# EAGLE design rbtnk_bsp (EAGLE 7.7.0)
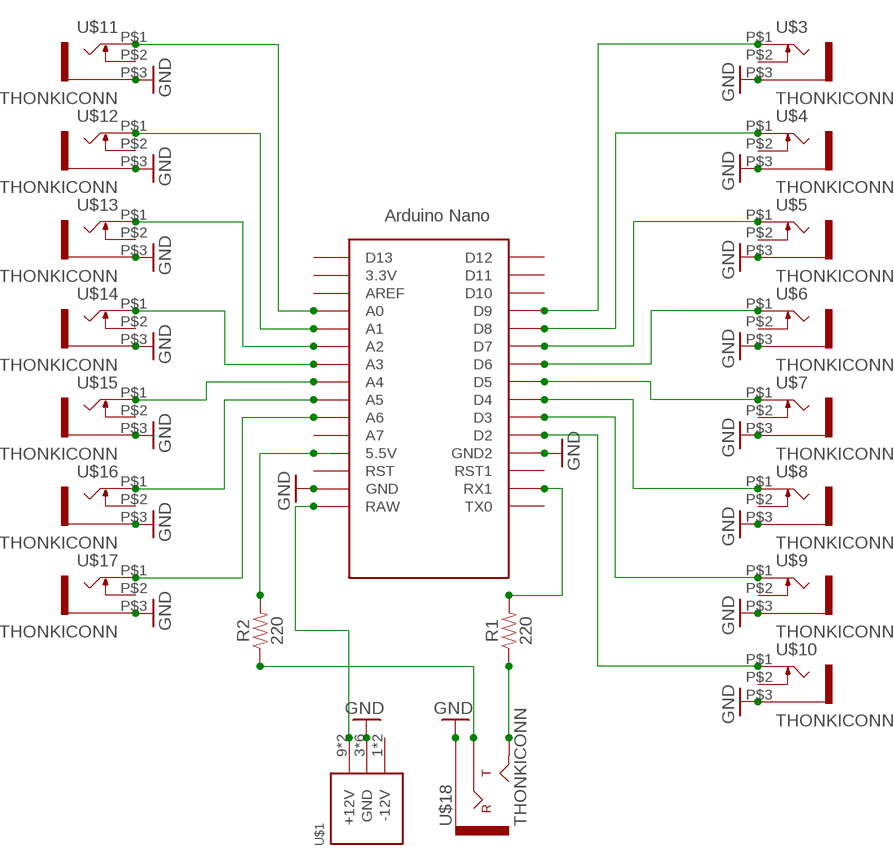
[diagram p0: schematic, sheet 1]

## Parts
R1  220  220OHM-0603-1/10W-1%  [0603]
R2  220  220OHM-0603-1/10W-1%  [0603]
U$1  POWER_SIMPLE10  [POWER_10]
U$2  NANO  [NANO]
U$3  THONKICONN  [THONKICONN]
U$4  THONKICONN  [THONKICONN]
U$5  THONKICONN  [THONKICONN]
U$6  THONKICONN  [THONKICONN]
U$7  THONKICONN  [THONKICONN]
U$8  THONKICONN  [THONKICONN]
U$9  THONKICONN  [THONKICONN]
U$10  THONKICONN  [THONKICONN]
U$11  THONKICONN  [THONKICONN]
U$12  THONKICONN  [THONKICONN]
U$13  THONKICONN  [THONKICONN]
U$14  THONKICONN  [THONKICONN]
U$15  THONKICONN  [THONKICONN]
U$16  THONKICONN  [THONKICONN]
U$17  THONKICONN  [THONKICONN]
U$18  THONKICONN  [THONKICONN]

## Nets
GND: U$1.3(GND) U$1.4(GND) U$1.5(GND) U$1.6(GND) U$1.7(GND) U$1.8(GND) U$2.GND U$2.GND1(GND2) U$3.P$3 U$4.P$3 U$5.P$3 U$6.P$3 U$7.P$3 U$8.P$3 U$9.P$3 U$10.P$3 U$11.P$3 U$12.P$3 U$13.P$3 U$14.P$3 U$15.P$3 U$16.P$3 U$17.P$3 U$18.P$1(EARTH)
N$1: U$2.A0 U$11.P$1
N$2: U$2.A1 U$12.P$1
N$3: U$2.A2 U$13.P$1
N$4: U$2.A3 U$14.P$1
N$5: U$2.A4 U$15.P$1
N$6: U$2.A5 U$16.P$1
N$7: U$2.A6 U$17.P$1
N$8: U$2.D2 U$10.P$1
N$9: U$2.D3 U$9.P$1
N$10: U$2.D4 U$8.P$1
N$11: U$2.D5 U$7.P$1
N$12: U$2.D6 U$6.P$1
N$13: U$2.D7 U$5.P$1
N$14: U$2.D8 U$4.P$1
N$15: U$2.D9 U$3.P$1
N$16: R2.2 U$2.5V(5.5V)
N$17: R2.1 U$18.P$2(RING)
N$18: R1.1 U$18.P$3(TIP)
N$19: R1.2 U$2.RX1
N$20: U$1.9(+12V) U$1.10(+12V) U$2.RAW
Unconnected: U$1.1(-12V) U$1.2(-12V) U$2.3.3V U$2.A7 U$2.AREF U$2.D10 U$2.D11 U$2.D12 U$2.D13 U$2.ICSP1 U$2.ICSP2 U$2.ICSP3 U$2.ICSP4 U$2.ICSP5 U$2.ICSP6 U$2.RST U$2.RST1 U$2.TX0 U$3.P$2 U$4.P$2 U$5.P$2 U$6.P$2 U$7.P$2 U$8.P$2 U$9.P$2 U$10.P$2 U$11.P$2 U$12.P$2 U$13.P$2 U$14.P$2 U$15.P$2 U$16.P$2 U$17.P$2

## Library data of the parts
R1 R2 = SparkFun-Resistors:220OHM: 220Ω resistor A resistor is a passive two-terminal electrical component that implements electrical resistance as a circuit element. Resistors act to reduce current flow, and, at the same time, act to lower voltage levels within circuits. - Wikipedia; PROD_ID: RES-07861
U$1 = eurorack_power:POWER_SIMPLE
U$2 = Arduino-clone:NANO: Arduino Nano
U$3-U$17 = thonkiconn:THONKICONN
U$18 = pj301cm:THONKICONN

## Board
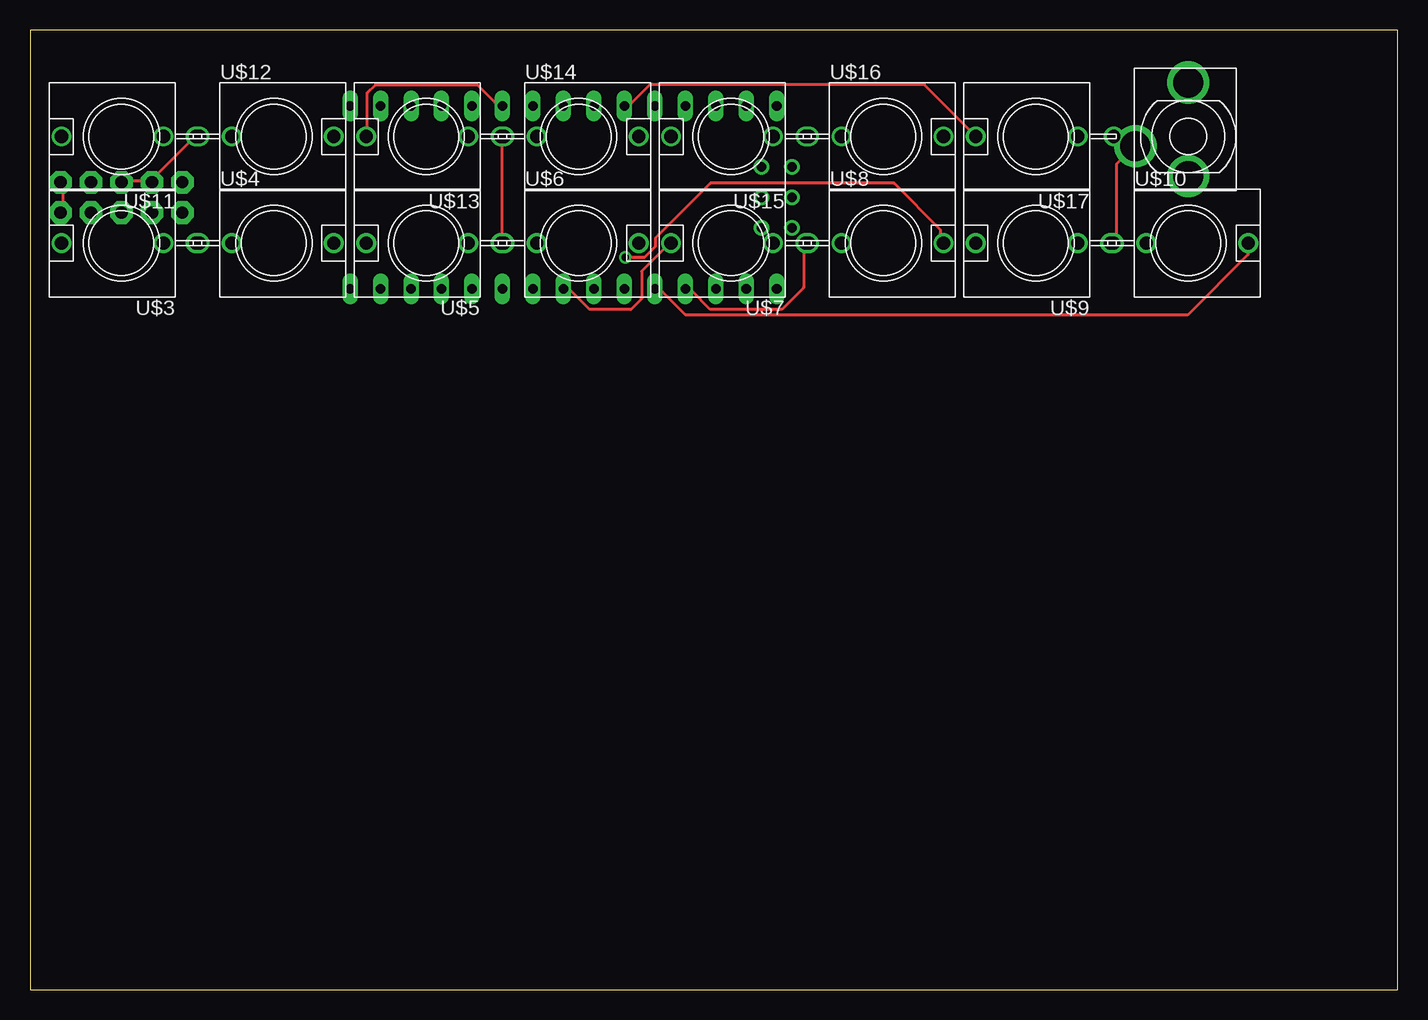
[diagram p1: board, top side]
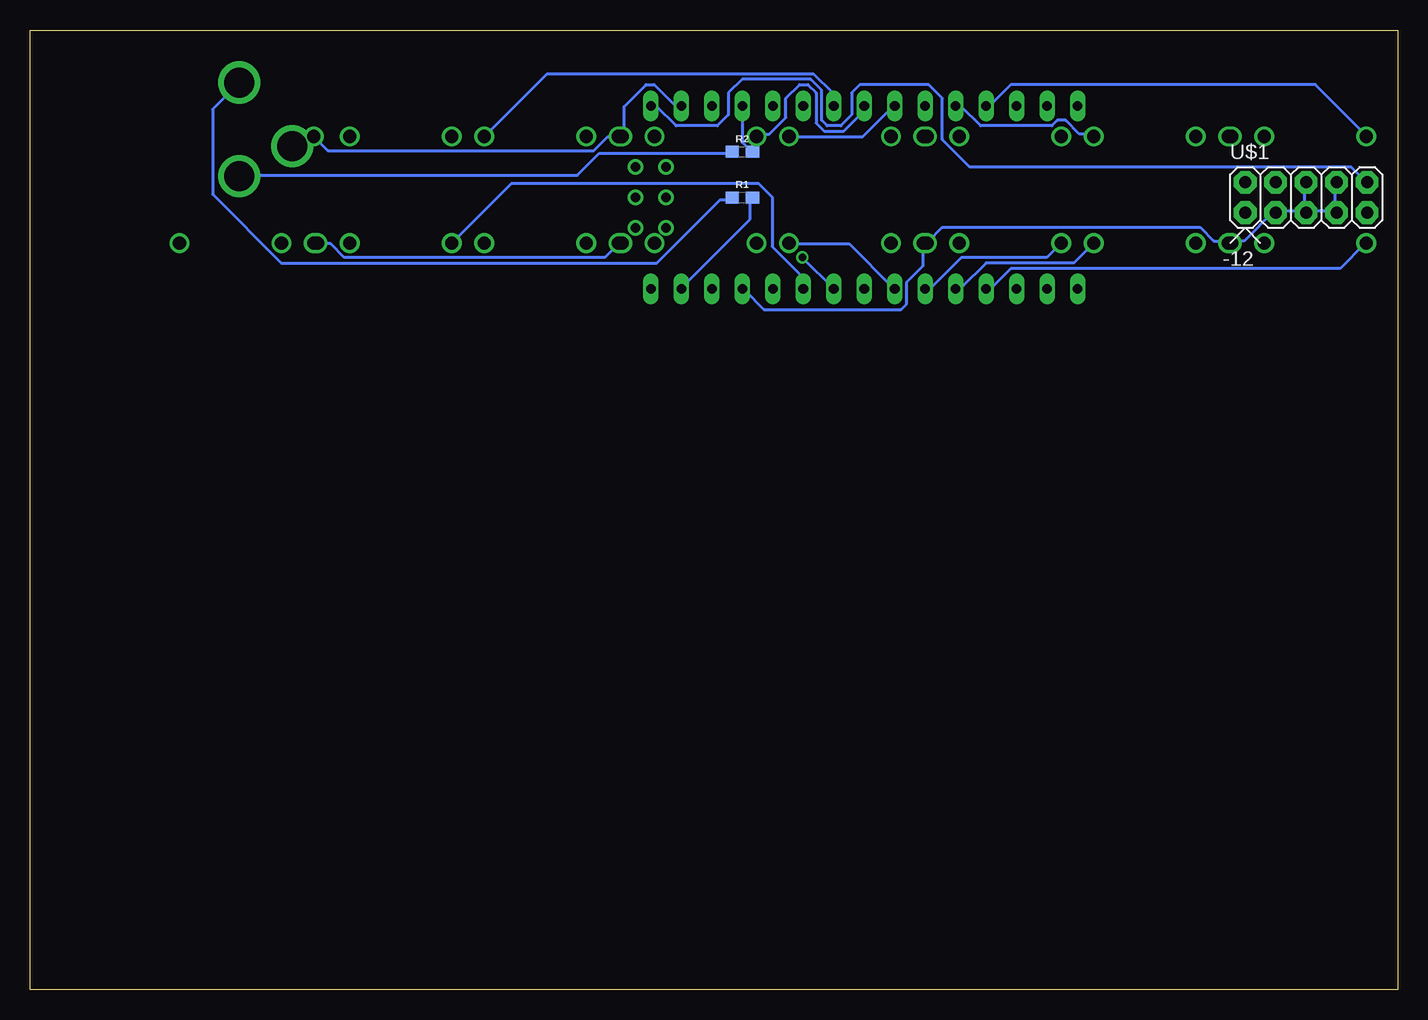
[diagram p2: board, bottom side, seen from below]

Size 113.97 x 80 mm. Coordinates in mm from the lower left corner, seen from the top.
Outline: 0,0 113.97,0 113.97,80 0,80 0,0
Copper layers (1*16): Top 0.035mm / dielectric 1.5mm / Bottom 0.035mm
Design rules "default": minimum track width 10mil, minimum drill 24mil, track to track 8mil, track to pad 8mil, pad to pad 8mil, via to via 8mil, smd to smd 8mil, copper to edge 40mil, drill to drill 8mil, minimum pad ring 10mil, minimum via ring 8mil, stop-mask expansion 4mil, vias tented up to drill 0mil, thermal gap 10mil

### Footprints (pad centres in the part's own frame; a part is rotated, then mirrored left to right if it is on the bottom)
0603 = smd 1.1 x 1: 1 -0.85,0; 2 0.85,0
POWER_10 = drill 1.016 pad 1.88 octagon: 1 -5.08,-1.27; 2 -5.08,1.27; 3 -2.54,-1.27; 4 -2.54,1.27; 5 0,-1.27; 6 0,1.27; 7 2.54,-1.27; 8 2.54,1.27; 9 5.08,-1.27; 10 5.08,1.27
NANO = drill 0.8 long: 3.3V -10.16,24.13; 5V -10.16,-1.27; A0 -10.16,19.05; A1 -10.16,16.51; A2 -10.16,13.97; A3 -10.16,11.43; A4 -10.16,8.89; A5 -10.16,6.35; A6 -10.16,3.81; A7 -10.16,1.27; AREF -10.16,21.59; D2 5.08,1.27; D3 5.08,3.81; D4 5.08,6.35; D5 5.08,8.89; D6 5.08,11.43; D7 5.08,13.97; D8 5.08,16.51; D9 5.08,19.05; D10 5.08,21.59; D11 5.08,24.13; D12 5.08,26.67; D13 -10.16,26.67; GND -10.16,-6.35; GND1 5.08,-1.27; RAW -10.16,-8.89; RST -10.16,-3.81; RST1 5.08,-3.81; RX1 5.08,-6.35; TX0 5.08,-8.89 | drill 0.8: ICSP1 -5.08,-10.16; ICSP2 -5.08,-7.62; ICSP3 -2.54,-10.16; ICSP4 -2.54,-7.62; ICSP5 0,-10.16; ICSP6 0,-7.62
THONKICONN = drill 1.1: P$1 0,5; P$2 0,-3.5; P$3 0,-6.5
THONKICONN' = drill 2.5: P$1 4.4,0.8; P$2 0,3.3; P$3 0,-4.5

### Placement (x,y rotation side)
R1  54.61,66.04 0 bottom
R2  54.61,69.85 0 bottom
U$1  7.62,66.04 0 bottom
U$2  53.34,63.5 270 bottom
U$3  7.62,62.23 90 top
U$4  20.32,62.23 270 top
U$5  33.02,62.23 90 top
U$6  45.72,62.23 270 top
U$7  58.42,62.23 90 top
U$8  71.12,62.23 270 top
U$9  83.82,62.23 90 top
U$10  96.52,62.23 270 top
U$11  7.62,71.12 90 top
U$12  20.32,71.12 270 top
U$13  33.02,71.12 90 top
U$14  45.72,71.12 270 top
U$15  58.42,71.12 90 top
U$16  71.12,71.12 270 top
U$17  83.82,71.12 90 top
U$18  THONKICONN  [THONKICONN']  96.52,71.12 180 top

### Tracks (layer width: path | path; a pad name or v marks a point on that pad's centre or on a via)
GND
  Top 0.254: U$15.P$3 64.69,71.09 U$16.P$3 | U$9.P$3 90.3,62.18 90.07,62.18 U$10.P$3 90.53,62.41 90.53,68.81 91.9,70.18 U$18.P$1 91.9,70.41 91.21,71.09 90.53,71.09 U$17.P$3 | U$11.P$3 13.95,71.09 U$12.P$3 13.72,71.09 10.06,67.44 | U$4.P$3 13.95,62.18 U$3.P$3 | 10.06,67.44 7.77,67.44 U$1.6 | 10.06,67.44 U$1.4 | U$5.P$3 39.32,62.18 U$6.P$3 39.32,62.41 39.32,71.09 | 39.32,71.09 U$13.P$3 | 39.32,71.09 U$14.P$3 | U$2.GND1 54.63,58.29 55.09,58.29 56.69,56.69 62.64,56.69 64.47,58.52 64.47,62.18 U$8.P$3 64.69,62.18 U$7.P$3
  Bottom 0.254: U$2.GND 59.89,73.84 60.35,73.84 61.95,75.44 62.64,75.44 64.47,73.61 64.47,71.32 U$16.P$3 | U$15.P$3 64.92,71.09 65.84,71.09 66.98,69.95 89.15,69.95 90.3,71.09 U$17.P$3 | 5.26,64.92 5.26,67.21 U$1.8 | 7.77,64.92 7.77,67.21 U$1.6 | 5.26,64.92 7.54,64.92 U$1.5 7.77,64.92 | 5.26,64.92 U$1.7 | 7.77,64.92 10.06,64.92 U$1.3 10.29,64.92 12.8,62.41 13.72,62.41 U$4.P$3 14.17,62.41 15.32,62.41 16.46,63.55 37.95,63.55 39.09,62.41 U$6.P$3 39.55,62.18 39.55,60.35 40.92,58.98 40.92,57.15 41.38,56.69 52.81,56.69 54.41,58.29 U$2.GND1 | U$10.P$3 89.84,62.18 88.92,62.18 87.78,61.04 66.06,61.04 64.92,62.18 U$7.P$3
N$1
  Bottom 0.254: U$2.A0 34.29,73.84 33.83,73.84 32.23,75.44 6.86,75.44 2.74,71.32 U$11.P$1
N$2
  Bottom 0.254: U$2.A1 36.8,73.61 36.35,73.61 34.75,72.01 28.8,72.01 28.35,72.47 27.66,72.47 26.52,71.32 25.38,71.32 U$12.P$1
N$3
  Top 0.254: U$2.A2 39.32,73.84 38.86,73.84 37.26,75.44 28.8,75.44 28.12,74.75 28.12,71.32 U$13.P$1
N$4
  Bottom 0.254: U$2.A3 42.06,73.61 44.58,71.09 50.52,71.09 U$14.P$1
N$5
  Bottom 0.254: U$2.A4 44.58,73.61 44.58,73.15 46.18,71.55 47.78,71.55 48.46,72.24 48.46,74.75 49.15,75.44 49.84,75.44 50.98,74.3 50.98,72.69 52.35,71.32 53.26,71.32 U$15.P$1
N$6
  Bottom 0.254: U$2.A5 47.09,73.84 47.09,74.75 48.69,76.35 70.87,76.35 75.89,71.32 U$16.P$1
N$7
  Top 0.254: U$2.A6 49.61,73.84 50.06,73.84 51.66,75.44 74.52,75.44 78.64,71.32 U$17.P$1
N$8
  Top 0.254: U$2.D2 52.12,58.29 52.58,58.29 54.63,56.24 96.47,56.24 101.5,61.27 101.5,62.18 U$10.P$1
N$9
  Bottom 0.254: U$2.D3 49.61,58.52 49.61,59.44 52.12,61.95 52.12,66.06 53.26,67.21 73.84,67.21 78.64,62.41 U$9.P$1
N$10  (via drill 0.61)
  Top 0.254: v49.61,61.04 51.21,61.04 52.12,61.95 52.12,62.64 56.69,67.21 72.01,67.21 75.89,63.32 75.89,62.41 U$8.P$1
  Bottom 0.254: v49.61,61.04 U$2.D4
N$11
  Top 0.254: U$2.D5 44.58,58.29 45.03,58.29 46.63,56.69 50.06,56.69 50.98,57.61 50.98,59.89 53.26,62.18 U$7.P$1
N$12
  Bottom 0.254: U$2.D6 42.06,58.52 45.72,62.18 50.52,62.18 U$6.P$1
N$13
  Bottom 0.254: U$2.D7 39.32,58.52 38.86,58.52 36.35,61.04 29.26,61.04 28.12,62.18 U$5.P$1
N$14
  Bottom 0.254: U$2.D8 36.8,58.52 36.35,58.52 34.29,60.58 26.98,60.58 25.38,62.18 U$4.P$1
N$15
  Bottom 0.254: U$2.D9 34.29,58.52 33.83,58.52 32.23,60.12 4.8,60.12 2.74,62.18 U$3.P$1
N$16
  Bottom 0.254: R2.2 53.95,69.95 54.63,70.64 54.63,73.61 U$2.5V
N$17
  Bottom 0.254: R2.1 55.55,69.72 66.52,69.72 68.35,67.89 96.47,67.89 U$18.P$2
N$18
  Bottom 0.254: R1.1 55.55,65.84 56.46,65.84 61.72,60.58 93.04,60.58 98.75,66.29 98.75,73.38 96.7,75.44 U$18.P$3
N$19
  Bottom 0.254: R1.2 53.95,65.84 53.95,64.24 59.66,58.52 U$2.RX1
N$20
  Top 0.254: U$1.9 2.74,64.92 2.74,67.21 U$1.10
  Bottom 0.254: U$2.RAW 62.18,73.61 61.72,73.61 60.12,72.01 56.69,72.01 55.78,72.92 55.78,74.75 54.63,75.89 48.92,75.89 48.01,74.98 48.01,72.47 47.55,72.01 46.41,72.01 45.49,72.92 45.49,74.75 44.81,75.44 39.09,75.44 37.95,74.3 37.95,70.87 35.66,68.58 3.89,68.58 2.74,67.44 U$1.10